# EAGLE schematic schematic_storing_data_eeprom_shutdown (EAGLE 9.6.2)
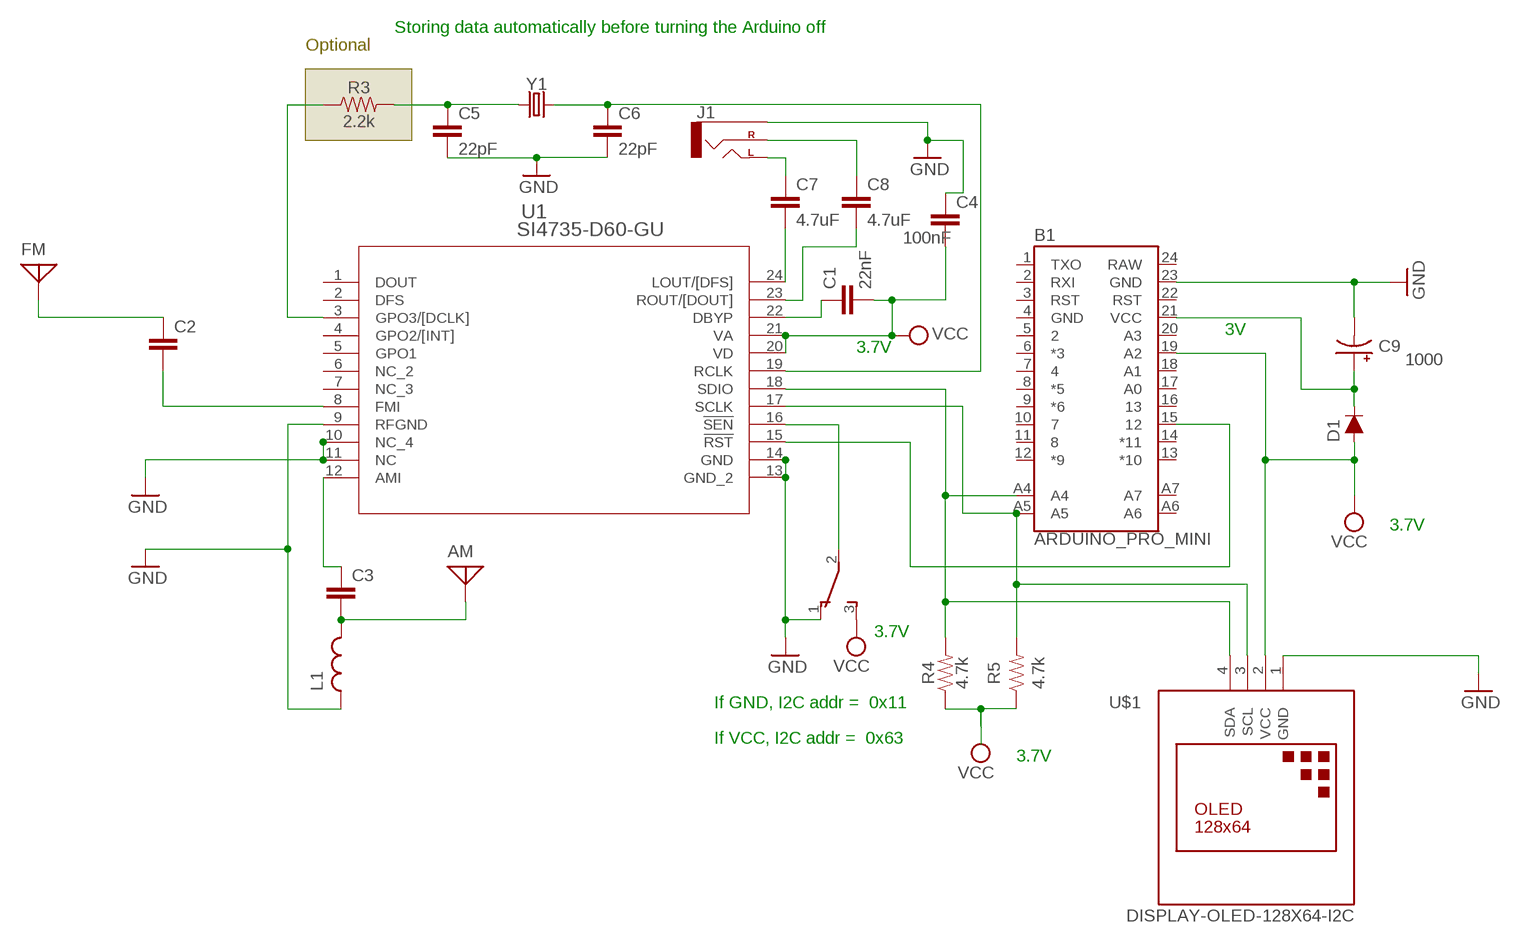
[diagram p0: schematic, sheet 1]

## Parts
AM  ANTENNA  [PAD-01]
B1  ARDUINO_PRO_MINI  [ARDUINO_PRO_MINI]
C1  22nF  22NF/22,000PF-0603-50V-10%  [0603]
C2  CXXC10B6  [XC10B6]
C3  CXXC10B6  [XC10B6]
C4  100nF  CXXC10B6  [XC10B6]
C5  22pF  22PF-0603-50V-5%  [0603]
C6  22pF  22PF-0603-50V-5%  [0603]
C7  4.7uF  4.7UF-1206-16V-(+80/-20%)  [1206]
C8  4.7uF  4.7UF-1206-16V-(+80/-20%)  [1206]
C9  1mf  1000UF-RADIAL-5MM-35V-20%-KIT  [CPOL-RADIAL-5MM-10MM-KIT]
D1  200mA/100V/1V  DIODE-1N4148  [DIODE-1N4148]
FM  ANTENNA  [PAD-01]
J1  AUDIO_JACK_2.5MMSPECIAL_POGO_PINS  [STEREOJACK2.5MM_SPECIAL_POGOPINS]
L1  L  (no package)
R3  2.2k  2.2KOHM-0603-1/10W-1%  [0603]
R4  4.7k  4.7KOHM-0603-1/10W-1%  [0603]
R5  4.7k  4.7KOHM-0603-1/10W-1%  [0603]
S1  TL36WO  [TL3XWO]
U1  SI4735-D60-GU  [SSOP24_SIL]
U$1  DISPLAY-OLED-128X64-I2C  [DISPLAY-OLED-128X64-I2C]
Y1  CRYSTALPTH-2X6  [CRYSTAL-PTH-2X6-CYL]

## Nets
GND: B1.23(GND) C4.1 C5.2 C6.2 C9.- J1.RING1(SLEEVE) L1.1 S1.1(O) U1.9(RFGND) U1.10(NC_4) U1.11(NC) U1.13(GND_2) U1.14(GND) U$1.1(GND)
N$1: B1.15 U1.15(!RST)
N$2: S1.2(P) U1.16(!SEN)
N$3: C6.1 U1.19(RCLK) Y1.2
N$4: C1.1 U1.22(DBYP)
N$5: R3.1 U1.3(GPO3/[DCLK])
N$6: C7.2 U1.24(LOUT/[DFS])
N$7: C8.2 U1.23(ROUT/[DOUT])
N$8: C7.1 J1.SHIELD(LEFT)
N$9: C8.1 J1.TIP(RIGHT)
N$10: AM.1 C3.2 L1.2
N$11: C5.1 R3.2 Y1.1
N$12: C3.1 U1.12(AMI)
N$13: C2.2 U1.8(FMI)
N$14: C2.1 FM.1
N$15: B1.A4 R4.2 U1.18(SDIO) U$1.4(SDA)
N$16: B1.21(VCC) C9.+ D1.C
SDA: B1.A5 R5.2 U1.17(SCLK) U$1.3(SCL)
VCC: B1.19(A2) C1.2 C4.2 D1.A R4.1 R5.1 S1.3(S) U1.20(VD) U1.21(VA) U$1.2(VCC)
Unconnected: B1.1(TXO) B1.2(RXI) B1.3(RST) B1.5 B1.6(*3) B1.7 B1.8(*5) B1.9(*6) B1.10 B1.11 B1.12(*9) B1.13(*10) B1.14(*11) B1.16 B1.17(A0) B1.18(A1) B1.20(A3) B1.22(RST) B1.A6 B1.A7 U1.1(DOUT) U1.2(DFS) U1.4(GPO2/[INT]) U1.5(GPO1) U1.6(NC_2) U1.7(NC_3)

## Notes on the sheet
- Storing data automatically before turning the Arduino off
- Optional
- ˜3V
- 3.7V
- 3.7V
- 3.7V
- If GND, I2C addr =  0x11
- If VCC, I2C addr =  0x63
- 3.7V

## Power pins joined to a net without a drawn wire
GND: B1.4(GND)
RAW: B1.24(RAW)

## Library data of the parts
AM FM = discrete:ANTENNA: Antenna
B1 = SparkFun-Boards:ARDUINO_PRO_MINI: SparkFun Pro Mini Pro Mini compatible footprint. Dimensions: 0.7 x 1.3" PCB Thickness: 0.8mm SparkFun Products: 3.3V/8MHz <https://www.sparkfun.com/products/11114> 5V/16MHz <https://www.sparkfun.com/products/11113>
C1 = SparkFun-Capacitors:22NF/22,000PF: 0.022uF/22nF/22,000pF ceramic capacitors A capacitor is a passive two-terminal electrical component used to store electrical energy temporarily in an electric field.; PROD_ID: CAP-07885
C2-C4 = rcl:CX: X CAPACITOR for power line; SPICEPREFIX: C
C5 C6 = SparkFun-Capacitors:22PF: 22pF ceramic capacitors A capacitor is a passive two-terminal electrical component used to store electrical energy temporarily in an electric field.; PROD_ID: CAP-07876
C7 C8 = SparkFun-Capacitors:4.7UF: 4.7µF ceramic capacitors A capacitor is a passive two-terminal electrical component used to store electrical energy temporarily in an electric field.; PROD_ID: CAP-10300
C9 = SparkFun-Capacitors:1000UF: 1,000µF/1mF ceramic capacitors A capacitor is a passive two-terminal electrical component used to store electrical energy temporarily in an electric field. CAP-08070; PROD_ID: CAP-09538; UF: 1000
D1 = SparkFun-DiscreteSemi:DIODE: Diode These are standard reverse protection diodes and small signal diodes. SparkFun Products: SparkFun SparkPunk Sound Kit <https://www.sparkfun.com/products/11177> SparkFun ESP8266 Thing <https://www.sparkfun.com/products/13231>; PROD_ID: DIO-08378
J1 = SparkFun-Connectors:AUDIO_JACK_2.5MM: Audio Jack 2.5mm variants of PTH and SMT audio jacks. SparkFun Products: SparkFun PicoBoard <https://www.sparkfun.com/products/11888>- 2.5mm SMD
L1 = ngspice-simulation:L: INDUCTOR
R3 = SparkFun-Resistors:2.2KOHM: 2.2kΩ resistor A resistor is a passive two-terminal electrical component that implements electrical resistance as a circuit element. Resistors act to reduce current flow, and, at the same time, act to lower voltage levels within circuits. - Wikipedia; PROD_ID: RES-08272
R4 R5 = SparkFun-Resistors:4.7KOHM: 4.7kΩ resistor A resistor is a passive two-terminal electrical component that implements electrical resistance as a circuit element. Resistors act to reduce current flow, and, at the same time, act to lower voltage levels within circuits. - Wikipedia; PROD_ID: RES-07857
S1 = switch:TL36WO: TINY SWITCH ON - ON Source: http://www2.produktinfo.conrad.com/datenblaetter/700000-724999/705152-da-01-de-Subminiaturschalter_TL_36WO.pdf
U1 = si4735:SI4735-D60-GU; BUILT_BY: EMA_Cory; COPYRIGHT: Copyright (C) 2018 Accelerated Designs. All rights reserved; DATASHEET: https://www.silabs.com/documents/public/data-sheets/Si4730-31-34-35-D60.pdf; MANUFACTURER_PART_NUMBER: SI4735-D60-GU; SOURCELIBRARY: Silicon_Labs_2020-04-23; VENDOR: Silicon Labs
U$1 = diy-modules:DISPLAY-OLED-128X64-I2C: 128x64 Dot Matrix OLED Module based on SSD1306 chip Variant with I2C interface More details available here: http://www.instructables.com/id/Monochrome-096-i2c-OLED-display-with-arduino-SSD13/ SSD1306 datasheet: https://cdn-shop.adafruit.com/datasheets/SSD1306.pdf Click here to find device on ebay.com <http://www.ebay.com/sch/oled+display+128x64+iic> Note: There are two variants: I2C and SPI. Search for the proper version.
Y1 = SparkFun-Clocks:CRYSTAL: Crystals (Generic) These are passive quartz crystals, which can be used as a clock source for a microcontroller. Crystal's are two-terminal devices. They require external "load" capacitors to generate an oscillating signal.